# EAGLE design PCB-CCU-IRISCTRL_ETHERMEGA (EAGLE 7.1.0)

## Sheet 1 of 2
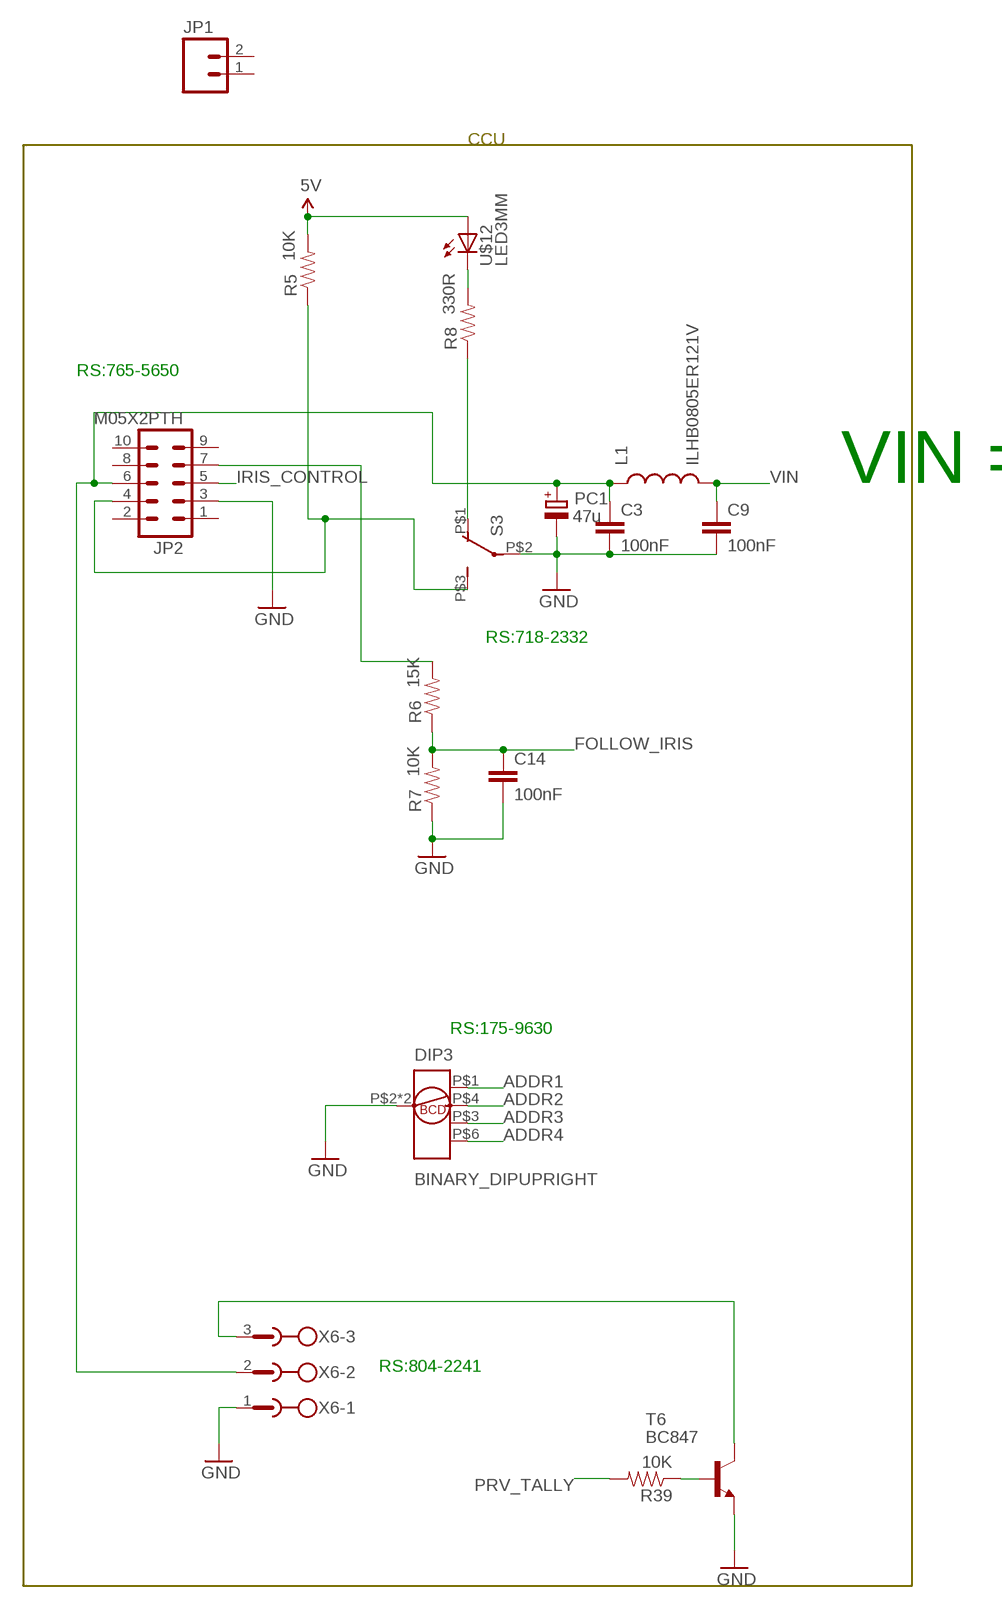
[diagram p0: schematic, sheet 1, part 1 of 3]
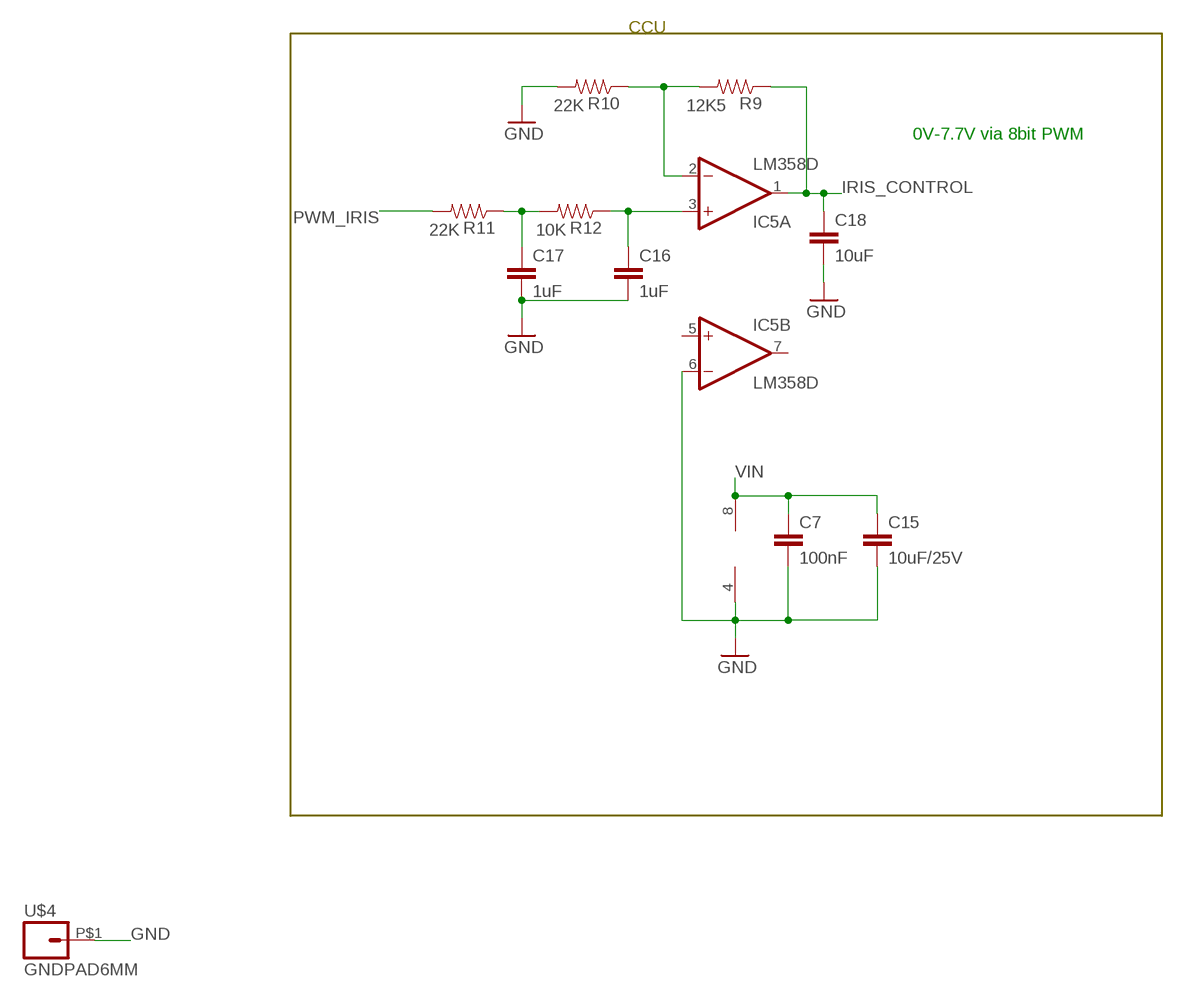
[diagram p1: schematic, sheet 1, part 2 of 3]
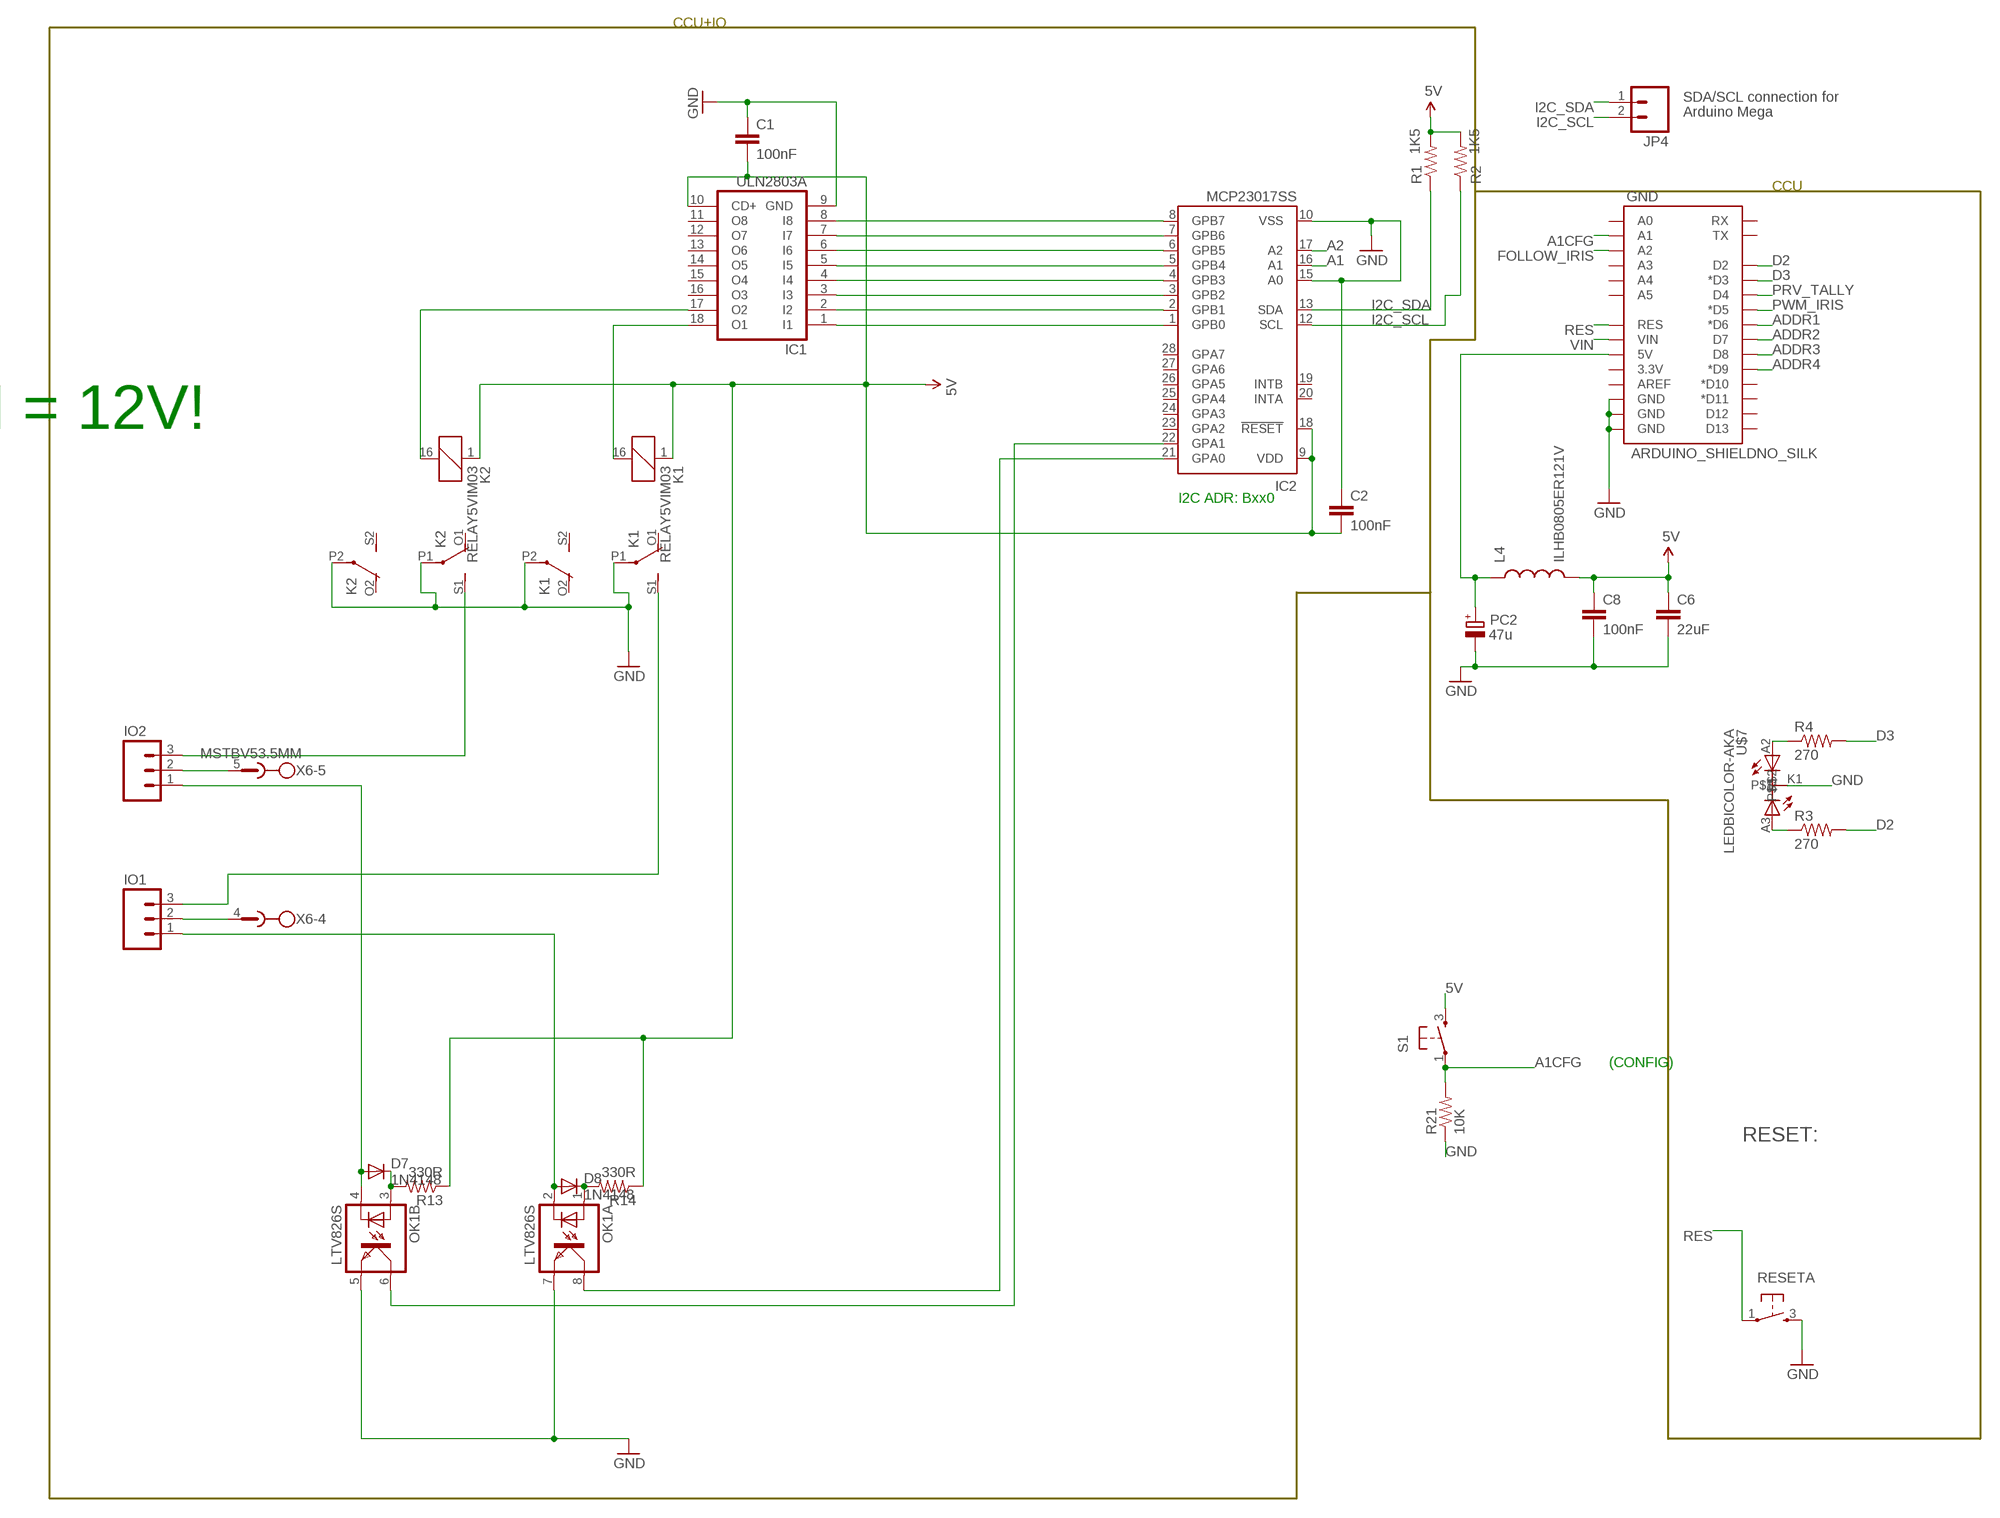
[diagram p2: schematic, sheet 1, part 3 of 3]

### Parts
C1  100nF  CAP0805  [0805]
C2  100nF  CAP0603-CAP  [0603-CAP]
C3  100nF  CAP0603-CAP  [0603-CAP]
C6  22uF  CAP0805  [0805]
C7  100nF  CAP0603-CAP  [0603-CAP]
C8  100nF  CAP0603-CAP  [0603-CAP]
C9  100nF  CAP0603-CAP  [0603-CAP]
C14  100nF  CAP0603-CAP  [0603-CAP]
C15  10uF/25V  CAP0805  [0805]
C16  1uF  CAP0805  [0805]
C17  1uF  CAP0805  [0805]
C18  10uF  CAP0805  [0805]
D7  1N4148  DIODESOD  [SOD-323]
D8  1N4148  DIODESOD  [SOD-323]
DIP3  BINARY_DIPUPRIGHT  [P65SMT_UPRIGHT_TH]
GND  ARDUINO_SHIELDNO_SILK  [DUEMILANOVE_VIAS]
IC1  ULN2803A  ULN2803ASO18W  [SO18W]
IC2  MCP23017SS  [SSOP28]
IC5  LM358D  [SO08]
IO1  M03LOCK  [1X03_LOCK]
IO2  M03LOCK  [1X03_LOCK]
JP1  M02PTH  [1X02]
JP2  M05X2PTH  [AVR_ICSP]
JP4  M02PTH  [1X02]
K1  RELAY5VIM03  [DS2Y]
K2  RELAY5VIM03  [DS2Y]
L1  ILHB0805ER121V  INDUCTOR0805  [0805]
L4  ILHB0805ER121V  INDUCTOR0805  [0805]
OK1  LTV826S  [DIL8-SMD]
PC1  47u  CPOL-EUD  [PANASONIC_D]
PC2  47u  CPOL-EUD  [PANASONIC_D]
R1  1K5  RESISTOR0603-RES  [0603-RES]
R2  1K5  RESISTOR0603-RES  [0603-RES]
R3  270  RESISTOR0603-RES  [0603-RES]
R4  270  RESISTOR0603-RES  [0603-RES]
R5  10K  RESISTOR0603-RES  [0603-RES]
R6  15K  RESISTOR0603-RES  [0603-RES]
R7  10K  RESISTOR0603-RES  [0603-RES]
R8  330R  RESISTOR0603-RES  [0603-RES]
R9  12K5  RESISTOR0603-RES  [0603-RES]
R10  22K  RESISTOR0603-RES  [0603-RES]
R11  22K  RESISTOR0603-RES  [0603-RES]
R12  10K  RESISTOR0603-RES  [0603-RES]
R13  330R  RESISTOR0603-RES  [0603-RES]
R14  330R  RESISTOR0603-RES  [0603-RES]
R21  10K  RESISTOR0603-RES  [0603-RES]
R39  10K  RESISTOR0603-RES  [0603-RES]
RESETA  TAC_SWITCH  [PUSHBUTTON]
S1  TAC_SWITCH  [PUSHBUTTON]
S3  SWITCH-DPST  [TECONNECTIVITY-DPST]
T6  BC847  [SOT23]
U$4  GNDPAD6MM  [3.2MMPAD6MM]
U$7  LEDBICOLOR-AKA  [LED5MM-BICOLOR]
U$12  LED3MM  [LED3MM]
X6  MSTBV53.5MM  [MSTBV5-3.5]

### Nets
5V [Power]: C1.2 C2.2 C6.1 C8.1 IC1.10(CD+) IC2.9(VDD) IC2.18(!RESET) K1.1 K2.1 L4.2 R1.2 R2.2 R5.2 R13.1 R14.1 S1.3 U$12.A
_IRIS_MANUAL: JP2.4 R5.1 S3.P$3(S)
A1: IC2.16(A1)
A1CFG: GND.A1 R21.2 S1.1
A2: IC2.17(A2)
ADDR1: DIP3.P$1 GND.D6(*D6)
ADDR2: DIP3.P$4 GND.D7
ADDR3: DIP3.P$3 GND.D8
ADDR4: DIP3.P$6 GND.D9(*D9)
ARD_5V [Power]: GND.5V L4.1 PC2.+
D2: GND.D2 R3.2
D3: GND.D3(*D3) R4.2
FOLLOW_IRIS: C14.1 GND.A2 R6.1 R7.2
GND [Power]: C1.1 C2.1 C3.2 C6.2 C7.2 C8.2 C9.2 C14.2 C15.2 C16.2 C17.2 C18.2 DIP3.P$2(GND) DIP3.P$5(GND) GND.GND@0(GND) GND.GND@1(GND) GND.GND@2(GND) IC1.9(GND) IC2.10(VSS) IC2.15(A0) IC5.4(P:V-) IC5.6(B:-IN) JP2.3 K1.P1(2:P) K1.P2(3:P) K2.P1(2:P) K2.P2(3:P) OK1.5(B:EMIT) OK1.7(A:EMIT) PC1.- PC2.- R7.1 R10.2 R21.1 RESETA.3 S3.P$2(P) T6.2(E) U$4.P$1 U$7.K1 X6.1
I2C_SCL: IC2.12(SCL) JP4.2 R2.1
I2C_SDA: IC2.13(SDA) JP4.1 R1.1
IRIS_CONTROL: C18.1 IC5.1(A:OUT) JP2.5 R9.1
N$1: IO2.3 K2.S1(2:S)
N$4: IC1.18(O1) K1.16
N$5: IC1.1(I1) IC2.1(GPB0)
N$6: IO2.2 X6.5
N$7: R4.1 U$7.A2
N$9: IC1.17(O2) K2.16
N$10: IO1.3 K1.S1(2:S)
N$11: R3.1 U$7.A3
N$12: IO1.2 X6.4
N$13: R39.1 T6.1(B)
N$14: JP2.7 R6.2
N$15: R8.1 S3.P$1(O)
N$16 [Power]: C3.1 JP2.6 L1.1 PC1.+ X6.2
N$17: R8.2 U$12.K(C)
N$18: C17.1 R11.1 R12.2
N$20: C16.1 IC5.3(A:+IN) R12.1
N$22: IC5.2(A:-IN) R9.2 R10.1
N$34: IC1.2(I2) IC2.2(GPB1)
N$35: IC1.3(I3) IC2.3(GPB2)
N$36: IC1.4(I4) IC2.4(GPB3)
N$37: IC1.5(I5) IC2.5(GPB4)
N$38: IC1.6(I6) IC2.6(GPB5)
N$39: IC1.7(I7) IC2.7(GPB6)
N$40: IC1.8(I8) IC2.8(GPB7)
N$47: D7.1(C) OK1.3(B:A) R13.2
N$48: D8.1(C) OK1.1(A:A) R14.2
N$49 [INput lines]: D8.2(A) IO1.1 OK1.2(A:C)
N$51: IC2.21(GPA0) OK1.8(A:COL)
N$60 [INput lines]: D7.2(A) IO2.1 OK1.4(B:C)
N$68: IC2.22(GPA1) OK1.6(B:COL)
PRV_TALLY: GND.D4 R39.2
PWM_IRIS: GND.D5(*D5) R11.2
RES: GND.RES RESETA.1
RESET: T6.3(C) X6.3
VIN [Power]: C7.1 C9.1 C15.1 GND.VIN IC5.8(P:V+) L1.2
Unconnected: GND.3.3V GND.A0 GND.A3 GND.A4 GND.A5 GND.AREF GND.D10(*D10) GND.D11(*D11) GND.D12 GND.D13 GND.RX GND.TX IC1.11(O8) IC1.12(O7) IC1.13(O6) IC1.14(O5) IC1.15(O4) IC1.16(O3) IC2.19(INTB) IC2.20(INTA) IC2.23(GPA2) IC2.24(GPA3) IC2.25(GPA4) IC2.26(GPA5) IC2.27(GPA6) IC2.28(GPA7) IC5.5(B:+IN) IC5.7(B:OUT) JP1.1 JP1.2 JP2.1 JP2.2 JP2.8 JP2.9 JP2.10 K1.O1(2:O) K1.O2(3:O) K1.S2(3:S) K2.O1(2:O) K2.O2(3:O) K2.S2(3:S)

### Notes on the sheet
- CCU
- 0V-7.7V via 8bit PWM
- CCU+IO
- SDA/SCL connection for
- Arduino Mega
- CCU
- CCU
- RS:765-5650
- VIN = 12V!
- I2C ADR: Bxx0
- RS:718-2332
- RS:175-9630
- (CONFIG)
- RESET:
- RS:804-2241

## Sheet 2 of 2

## Library data of the parts
C1-C3 C6-C9 C14-C18 = SparkFun:CAP: Capacitor Standard 0603 ceramic capacitor, and 0.1" leaded capacitor.
D7 D8 = SparkFun-DiscreteSemi:DIODE: Diode These are standard reverse protection diodes and small signal diodes. SMA package can handle up to about 1A. SOD-323 can handle about 200mA. What the SOD-323 package when ordering, there are some mfgs out there that are 5-pin packages.; PROD_ID: DIO-09646
DIP3 = SKAARHOJ:BINARY_DIP
GND = SparkFun:ARDUINO_SHIELD
IC1 = uln-udn:ULN2803A: DRIVER ARRAY
IC2 = microchip:MCP23017: http://ww1.microchip.com/downloads/en/DeviceDoc/21952a.pdf Source: http://ww1.microchip.com/downloads/en/DeviceDoc/21952a.pdf; MF: MICROCHIP; MPN: MCP23017-E/SS; OC_FARNELL: 1467674; OC_NEWARK: 31K2960
IC5 = linear:LM358: OP AMP also LM158; LM258; LM2904 Source: http://cache.national.com/ds/LM/LM158.pdf
IO1 IO2 = SparkFun:M03: Header 3 Standard 3-pin 0.1" header. Use with straight break away headers (SKU : PRT-00116), right angle break away headers (PRT-00553), swiss pins (PRT-00743), machine pins (PRT-00117), and female headers (PRT-00115). Molex polarized connector foot print use with SKU : PRT-08232 with associated crimp pins and housings.
JP1 JP4 = SparkFun:M02: Header 2 Standard 2-pin 0.1" header. Use with straight break away headers (SKU : PRT-00116), right angle break away headers (PRT-00553), swiss pins (PRT-00743), machine pins (PRT-00117), and female headers (PRT-00115). Molex polarized connector foot print use with SKU : PRT-08233 with associated crimp pins and housings.
JP2 = SparkFun:M05X2: Header 5x2 Standard 10-pin dual row 0.1" header. Commonly used with AVR-ISP. Use with Spark Fun Electronics SKU: PRT-00778
K1 K2 = SKAARHOJ:RELAY5V: RELAY 2 x switch, AxiCom 150 mW 5V
L1 L4 = SparkFun:INDUCTOR: Inductors Basic Inductor/Choke - 0603 and 1206. Footprints are not proven and vary greatly between part numbers.
OK1 = optocoupler:LTV826: OPTO COUPLER Source: LITEON, LTV816.pdf; OC_FARNELL: unknown; OC_NEWARK: unknown
PC1 PC2 = rcl:CPOL-EU: POLARIZED CAPACITOR, European symbol
R1-R14 R21 R39 = SparkFun:RESISTOR: Resistor Basic schematic elements and footprints for 0603, 1206, and PTH resistors.
RESETA S1 = SKAARHOJ:TAC_SWITCH: Momentary Switch Button commonly used for reset or general input. Spark Fun Electronics SKU : COM-00097
S3 = SKAARHOJ:SWITCH-DPST: DPDT Version of the COM-00597
T6 = transistor:BC847: NPN TRANSISTOR
U$4 = SKAARHOJ:GNDPAD
U$7 = SKAARHOJ:LEDBICOLOR-AKA
U$12 = SKAARHOJ:LED: KINGBRIGHT 20MM BIG LAMP
X6 = SKAARHOJ:MSTBV5: PHOENIX

## Net classes
0 default: width 0.203 mm, clearance 0.203 mm
1 Power: width 0.305 mm, drill 0.305 mm, clearance 0.203 mm
2 RELAY LINES: width 0.305 mm, drill 0.305 mm, clearance 0.203 mm
3 INput lines: width 0.203 mm, clearance 0.203 mm

## Board
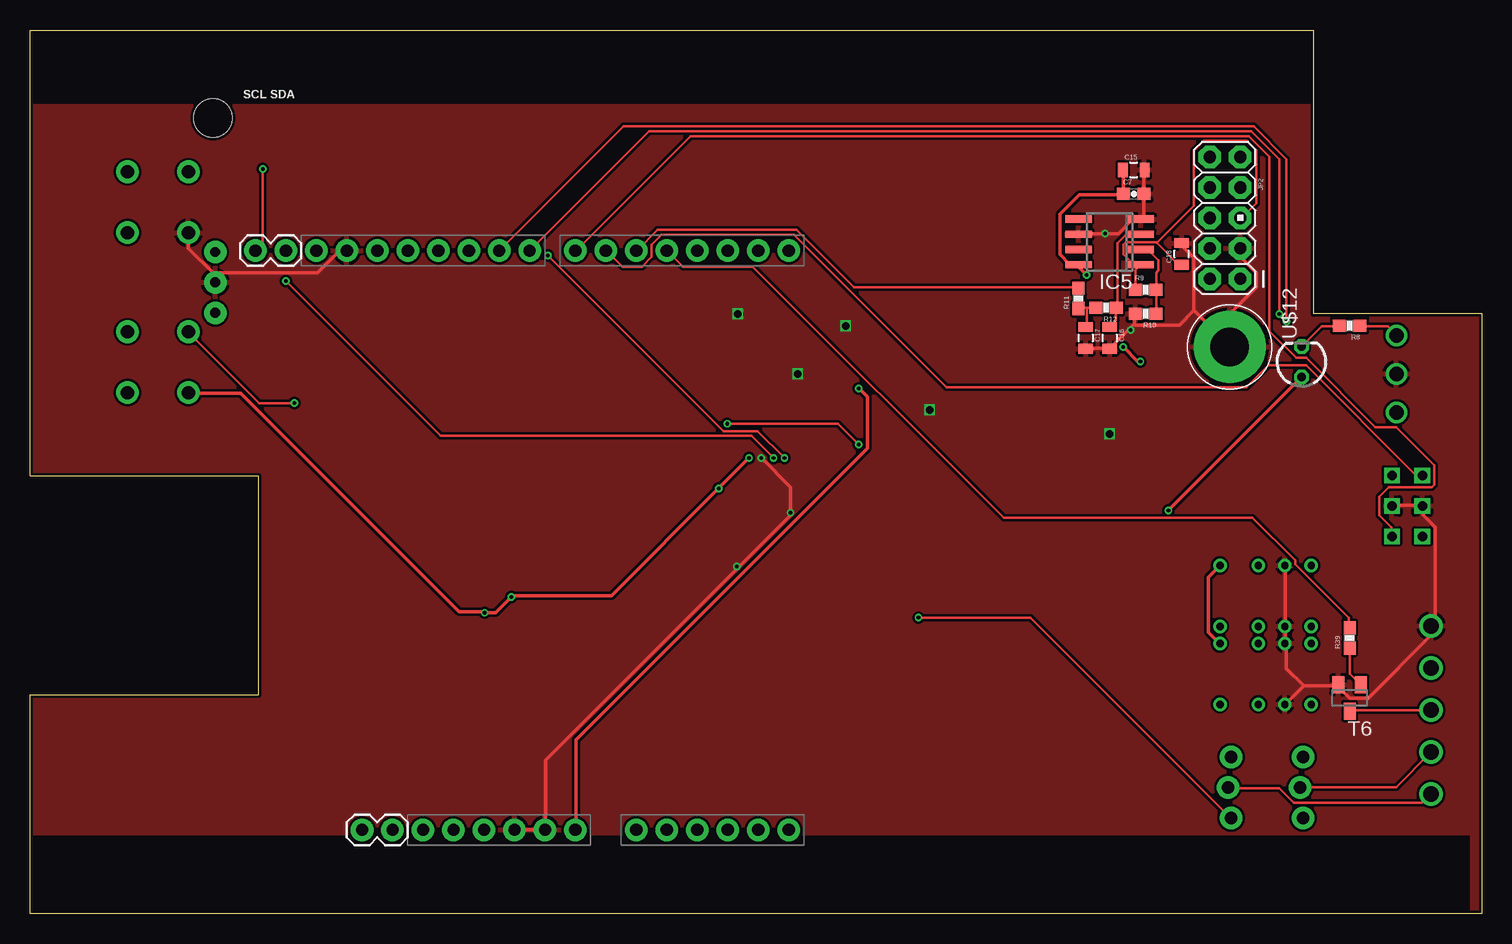
[diagram p3: board, top side]
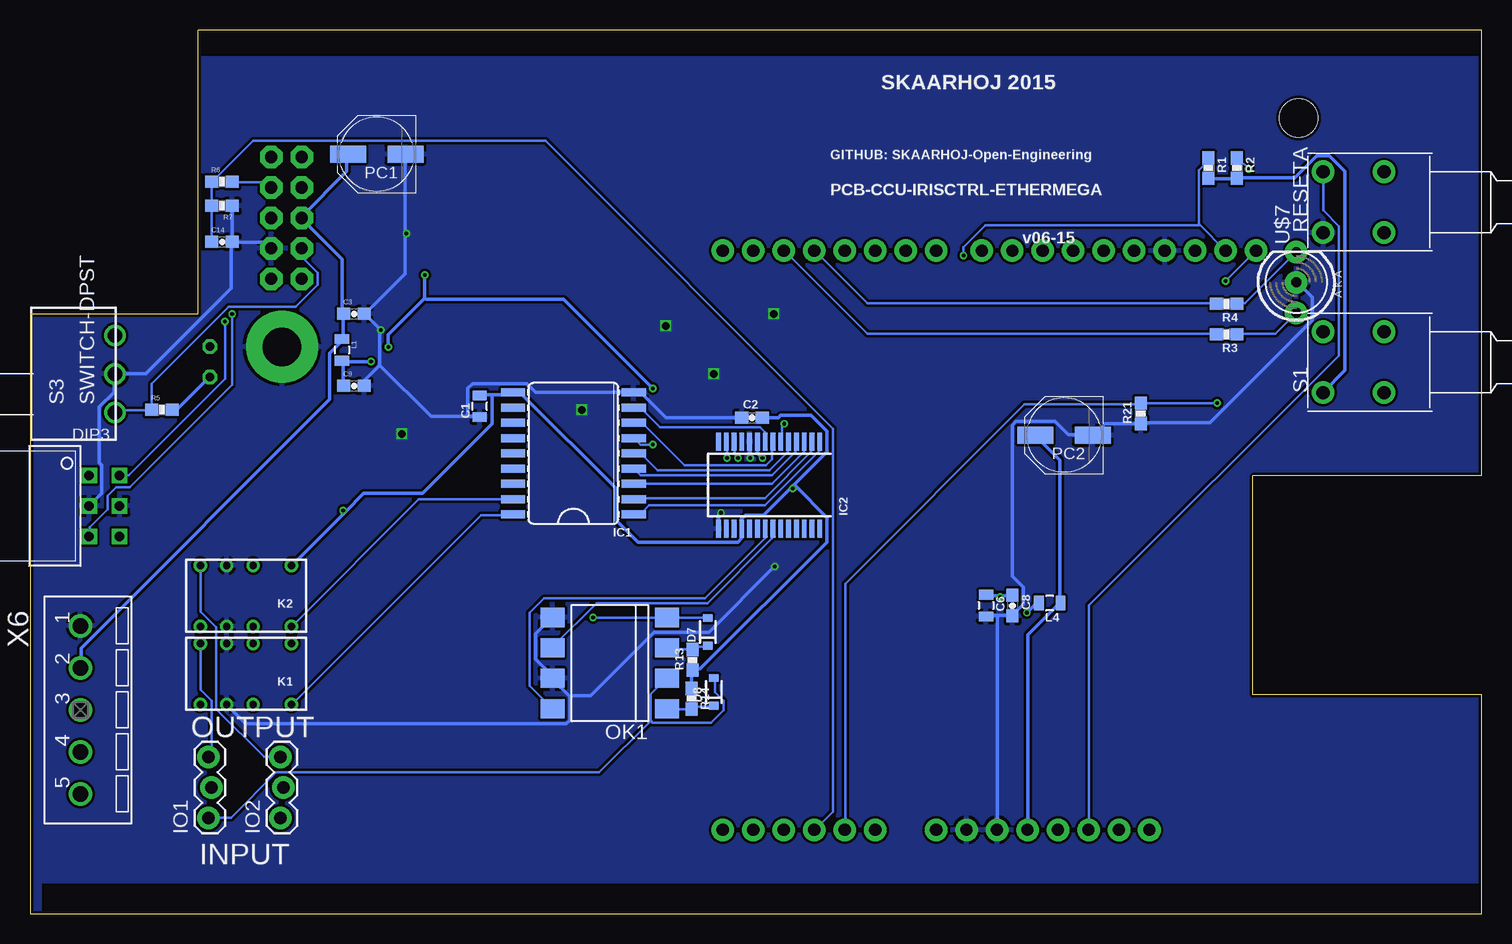
[diagram p4: board, bottom side, seen from below]

Size 121 x 73.66 mm. Coordinates in mm from the lower left corner, seen from the top.
Outline: 0,0 0,18.26 19.05,18.26 19.05,36.5 0,36.5 0,73.66 107,73.66 107,50 121,50 121,0 0,0
Copper layers (1*16): Top 0.035mm / dielectric 1.5mm / Bottom 0.035mm
Design rules "Fusion_eagle_rule_v1.1": minimum track width 6mil, minimum drill 12mil, track to track 6mil, track to pad 6mil, pad to pad 6mil, via to via 6mil, smd to smd 0mil, copper to edge 10mil, drill to drill 10mil, minimum pad ring 10mil, minimum via ring 6mil, stop-mask expansion 2mil, vias tented up to drill 100mil, thermal gap 10mil
Holes 3.2 mm at 15.24,66.31
tRestrict: area 0,0 to 120,6.5; area 0,67.5 to 107,74
bRestrict: area 0,71.5 to 107,74; area 0,0 to 120,2.5

### Footprints (pad centres in the part's own frame; a part is rotated, then mirrored left to right if it is on the bottom)
0805 = smd 0.8 x 1.2: 1 -0.9,0; 2 0.9,0
0603-CAP = smd 1.1 x 1: 1 -0.85,0; 2 0.85,0
SOD-323 = smd 0.63 x 0.83: 1 -1.15,0; 2 1.15,0
P65SMT_UPRIGHT_TH = drill 0.8 square: P$1 -2.54,-1.27; P$2 0,-1.27; P$3 2.54,-1.27; P$4 2.54,1.27; P$5 0,1.27; P$6 -2.54,1.27
DUEMILANOVE_VIAS = drill 1.016 pad 1.88: 3.3V 50.8,13.97; 5V 50.8,16.51; A0 50.8,29.21; A1 50.8,31.75; A2 50.8,34.29; A3 50.8,36.83; A4 50.8,39.37; A5 50.8,41.91; AREF 2.54,2.54; D2 2.54,36.83; D3 2.54,34.29; D4 2.54,31.75; D5 2.54,29.21; D6 2.54,26.67; D7 2.54,24.13; D8 2.54,20.32; D9 2.54,17.78; D10 2.54,15.24; D11 2.54,12.7; D12 2.54,10.16; D13 2.54,7.62; GND@0 50.8,19.05; GND@1 50.8,21.59; GND@2 2.54,5.08; RES 50.8,11.43; RX 2.54,41.91; TX 2.54,39.37; VIN 50.8,24.13
SO18W = smd 0.66 x 2.032: 1 -5.08,-5.029; 2 -3.81,-5.029; 3 -2.54,-5.029; 4 -1.27,-5.029; 5 0,-5.029; 6 1.27,-5.029; 7 2.54,-5.029; 8 3.81,-5.029; 9 5.08,-5.029; 10 5.08,5.029; 11 3.81,5.029; 12 2.54,5.029; 13 1.27,5.029; 14 0,5.029; 15 -1.27,5.029; 16 -2.54,5.029; 17 -3.81,5.029; 18 -5.08,5.029
SSOP28 = smd 0.4 x 1.5: 1 -4.225,-3.625; 2 -3.575,-3.625; 3 -2.925,-3.625; 4 -2.275,-3.625; 5 -1.625,-3.625; 6 -0.975,-3.625; 7 -0.325,-3.625; 8 0.325,-3.625; 9 0.975,-3.625; 10 1.625,-3.625; 11 2.275,-3.625; 12 2.925,-3.625; 13 3.575,-3.625; 14 4.225,-3.625; 15 4.225,3.625; 16 3.575,3.625; 17 2.925,3.625; 18 2.275,3.625; 19 1.625,3.625; 20 0.975,3.625; 21 0.325,3.625; 22 -0.325,3.625; 23 -0.975,3.625; 24 -1.625,3.625; 25 -2.275,3.625; 26 -2.925,3.625; 27 -3.575,3.625; 28 -4.225,3.625
SO08 = smd 0.6 x 2.2: 1 -1.905,-2.6; 2 -0.635,-2.6; 3 0.635,-2.6; 4 1.905,-2.6; 5 1.905,2.6; 6 0.635,2.6; 7 -0.635,2.6; 8 -1.905,2.6
1X03_LOCK = drill 1.016 pad 1.88: 1 0,0.127; 2 2.54,-0.127; 3 5.08,0.127
1X02 = drill 1.016 pad 1.88: 1 0,0; 2 2.54,0
AVR_ICSP = drill 1.016 pad 1.88 octagon: 1 -1.27,5.08; 2 1.27,5.08; 3 -1.27,2.54; 4 1.27,2.54; 5 -1.27,0; 6 1.27,0; 7 -1.27,-2.54; 8 1.27,-2.54; 9 -1.27,-5.08; 10 1.27,-5.08
DS2Y = drill 0.6: 1 1.2,0.46; 16 1.2,5.54; O1 4.4,0.46; O2 4.4,5.54; P1 6.6,0.46; P2 6.6,5.54; S1 8.8,0.46; S2 8.8,5.54
DIL8-SMD = smd 1.6 x 2: 1 -3.81,-4.77; 2 -1.27,-4.77; 3 1.27,-4.77; 4 3.81,-4.77; 5 3.81,4.77; 6 1.27,4.77; 7 -1.27,4.77; 8 -3.81,4.77
PANASONIC_D = smd 3 x 1.4: + 2.4,0; - -2.4,0
0603-RES = smd 1.1 x 1: 1 -0.85,0; 2 0.85,0
PUSHBUTTON = drill 1.1 pad 1.88: 1 2.54,2.54; 2 2.54,-2.54; 3 -2.54,2.54; 4 -2.54,-2.54
TECONNECTIVITY-DPST = drill 1.2: P$1 3,3.2; P$2 3,0; P$3 3,-3.2
SOT23 = smd 1 x 1.4: 1 -0.95,-1.1; 2 0.95,-1.1; 3 0,1.1
3.2MMPAD6MM = drill 3.2 pad 6: P$1 0,0
LED5MM-BICOLOR = drill 0.813 pad 1.88: A2 2.54,0; A3 -2.54,0; K1 0,0
LED3MM = drill 0.7 pad 1.2 octagon: A -1.27,0; K 1.27,0
MSTBV5-3.5 = drill 1.3: 1 -7,0; 2 -3.5,0; 3 0,0; 4 3.5,0; 5 7,0

### Placement (x,y rotation side)
C1  83.52,42.31 90 bottom
C2  60.81,41.35 0 bottom
C3  94,50 0 bottom
C6  41.3,25.7 270 bottom
C7  92,60 0 top
C8  39.1,25.7 270 bottom
C9  94,44 0 bottom
C14  105,56 0 bottom
C15  92,62 0 top
C16  90,48 270 top
C17  88,48 270 top
C18  96,55 90 top
D7  64.5,23.5 90 bottom
D8  64,18.5 90 bottom
DIP3  114.8,34 270 bottom
GND  21.34,57.81 270 top
IC1  75.7,38.38 90 bottom
IC2  59.39,35.73 180 bottom
IC5  90,56 90 top
IO1  106,8 90 bottom
IO2  100,8 90 bottom
JP1  27.69,7.01 0 top
JP2  99.62,58 180 top
JP4  21.34,55.27 180 top
K1  98,23 180 bottom
K2  98,29.5 180 bottom
L1  95,47 270 bottom
L4  36,25.9 180 bottom
OK1  72.67,20.9 90 bottom
PC1  92.1,63.3 180 bottom
PC2  34.8,39.9 180 bottom
R1  22.77,62.15 270 bottom
R2  20.4,62.15 270 bottom
R3  21.24,48.29 180 bottom
R4  21.24,50.83 180 bottom
R5  110,42 0 bottom
R6  105,61 0 bottom
R7  105,59 180 bottom
R8  110,49 180 top
R9  93,52 0 top
R10  93,50 180 top
R11  87.4,51.3 90 top
R12  89.7,50.5 180 top
R13  65.76,21.18 90 bottom
R14  65.86,17.93 270 bottom
R21  28.41,41.72 90 bottom
R39  110,23 90 top
RESETA  10.67,59.31 90 bottom
S1  10.67,45.97 90 bottom
S3  116.9,45 0 bottom
T6  110,18 180 top
U$4  100,47.25 0 top
U$7  15.44,52.63 90 bottom
U$12  106,46 90 top
X6  116.8,17 270 bottom

### Tracks (layer width: path | path; a pad name or v marks a point on that pad's centre or on a via)
5V  (via drill 0.3)
  Top 0.305: K1.1 99.16,22.55 98.25,23.47 98.25,28.04 99.16,28.96 K2.1 | v94.89,33.63 105.97,44.7 U$12.A | v59.94,38 v57.4,35.46 48.46,26.52 40.23,26.52 v40.13,26.42 38.81,25.09 v37.9,25.09 37.8,25.2 35.76,25.2 17.58,43.38 13.21,43.38 S1.3
  Bottom 0.305: R5.2 109.12,42.06 108.71,42.06 106.07,44.7 U$12.A | 82.5,43.28 80.87,43.28 80.77,43.38 IC1.10 80.67,43.28 79.96,43.28 72.14,35.46 72.14,32.82 70.31,30.99 61.98,30.99 61.67,31.29 61.67,32 IC2.18 61.67,32.92 61.37,33.22 59.84,33.22 57.51,35.56 | 82.5,43.28 83.52,43.28 C1.2 | 82.5,43.28 82.5,40.84 88.29,35.05 93.17,35.05 94.69,33.53 | 94.69,33.53 99.16,29.06 K2.1 | v94.89,33.63 94.79,33.63 94.69,33.53 | R1.2 22.76,61.27 20.42,61.27 R2.2 20.32,61.37 15.54,61.37 13.72,63.2 12.7,63.2 11.38,61.87 11.38,45.31 13.21,43.48 S1.3 | 40.13,26.52 41.25,26.52 C6.1 | 40.13,26.52 39.12,26.52 C8.1 | v37.9,25.09 37.19,25.81 36.98,25.81 L4.2 | v40.13,26.42 40.13,26.52 | R14.1 65.84,18.8 65.84,20.32 R13.1 65.63,20.42 65.13,20.42 54.56,30.99 54.56,33.02 57.2,35.66 v57.4,35.46 57.51,35.56 | 57.51,35.56 54.56,38.51 54.56,40.23 55.88,41.55 58.42,41.55 58.62,41.35 59.94,41.35 C2.2 | v59.94,38 60.35,38.41 60.35,39.32 IC2.9
_IRIS_MANUAL
  Bottom 0.203: S3.P$3 113.89,41.86 113.79,41.96 110.95,41.96 R5.1 110.85,42.06 110.85,44.2 104.44,50.6 98.86,50.6 97.03,52.43 97.03,53.44 98.35,54.76 98.35,55.37 JP2.4
A1CFG  (via drill 0.3)
  Top 0.203: v22.05,42.57 19.1,42.57 13.21,48.46 S1.1
  Bottom 0.203: v22.05,42.57 28.35,42.57 R21.2 28.45,42.47 38.1,42.47 53.03,27.53 53.03,7.01 GND.A1
ADDR1
  Top 0.203: DIP3.P$1 116.03,36.58 115.52,36.58 106.38,45.72 103.23,45.72 101.4,43.89 76.4,43.89 63.7,56.59 52.63,56.59 51.82,55.78 51.82,54.76 51,53.95 49.38,53.95 48.06,55.27 GND.D6
ADDR2
  Top 0.203: DIP3.P$4 113.49,31.5 113.49,32.21 112.47,33.22 112.47,34.75 113.28,35.56 116.84,35.56 117.04,35.76 117.04,37.39 113.89,40.54 112.17,40.54 106.38,46.33 105.56,46.33 103.33,48.56 103.33,63.09 101.6,64.82 55.07,64.82 45.52,55.27 GND.D7
ADDR3  (via drill 0.3)
  Top 0.203: v104.14,49.99 104.14,62.89 101.8,65.23 51.61,65.23 GND.D8
  Bottom 0.203: v104.14,49.99 104.14,44.09 112.67,35.56 113.79,35.56 114.5,34.85 114.5,33.73 116.03,32.21 116.03,31.5 DIP3.P$3
ADDR4  (via drill 0.3)
  Top 0.203: v104.75,49.38 104.75,62.89 102.01,65.63 49.48,65.63 GND.D9
  Bottom 0.203: v104.75,49.38 104.75,44.6 112.78,36.58 113.49,36.58 DIP3.P$6
ARD_5V
  Bottom 0.305: PC2.+ 37.19,39.83 35.15,37.8 35.15,25.91 L4.1 35.26,25.81 37.8,23.27 37.8,7.01 GND.5V
D2
  Bottom 0.203: R3.2 22.15,48.36 51.21,48.36 58.12,55.27 GND.D2
D3
  Bottom 0.203: R4.2 22.15,50.9 51.21,50.9 55.58,55.27 GND.D3
FOLLOW_IRIS
  Bottom 0.203: C14.1 105.87,56.08 105.87,58.93 R7.2 105.87,59.03 105.87,60.96 R6.1 105.77,61.06 102.41,64.41 78.03,64.41 54.05,40.44 54.05,8.53 55.58,7.01 GND.A2
GND  (via drill 0.3, 0.6)
  Top 0.305: C15.2 92.86,61.98 92.86,60.05 C7.2 92.86,59.84 92.86,58.12 92.66,57.91 IC5.4 92.46,57.91 91.95,57.91 90.73,56.69 v89.61,56.69 87.48,56.69 IC5.6 | 92.05,49.17 92.05,49.99 R10.2 | 91.64,48.77 90.02,47.14 C16.2 89.92,47.14 88.09,47.14 C17.2 | 91.64,48.77 92.05,49.17 | 97.03,50.29 97.03,54.66 96.01,55.68 96.01,55.88 C18.2 | 97.03,50.29 99.97,47.35 U$4.P$1 98.75,48.77 102.21,52.22 102.21,53.44 100.99,54.66 100.99,55.37 JP2.3 | 97.03,50.29 95.81,49.07 92.15,49.07 92.05,49.17 | DIP3.P$5 113.59,34.04 116.03,34.04 DIP3.P$2 116.13,33.93 116.13,33.22 117.14,32.21 117.14,24.38 116.84,24.08 X6.1 116.74,23.88 116.74,23.16 111.56,17.98 110.03,17.98 109.12,18.9 T6.2 109.02,19 106.17,19 | K2.P1 104.65,28.96 104.65,24.08 K2.P2 104.65,23.88 104.65,22.55 K1.P1 104.75,22.45 104.75,20.42 106.17,19 | 106.17,19 104.65,17.48 K1.P2 | v91.75,48.67 91.64,48.77 | RESETA.3 13.21,55.47 15.34,53.34 15.34,52.63 U$7.K1 15.44,53.44 23.98,53.44 25.81,55.27 GND.GND@2 | v60.96,38 63.4,35.56 v63.4,33.43 63.3,33.33 63.3,33.12 59.03,28.85 | GND.GND@0 GND.GND@1 42.98,7.11 42.98,12.8 59.03,28.85 | v58.93,28.96 59.03,28.85
  Bottom 0.305: C2.1 67.97,41.35 70,43.38 70.61,43.38 IC1.9 70.81,43.48 78.84,43.48 79.55,44.2 84.12,44.2 84.53,43.79 84.53,41.45 | 91.85,45.72 93.07,44.5 93.07,44.09 C9.2 | 91.85,48.67 91.85,48.77 93.07,49.99 C3.2 92.96,50.09 89.71,53.34 89.71,56.69 | 91.85,48.67 91.85,45.72 | 84.53,41.45 87.58,41.45 91.85,45.72 | 84.53,41.45 83.62,41.45 C1.1 | 89.71,56.69 89.71,63.3 PC1.- | v89.61,56.69 89.71,56.69 | C14.2 104.14,56.08 104.14,58.93 R7.1 | C14.2 104.04,55.98 101.5,55.98 100.99,55.47 JP2.3 | DIP3.P$2 116.03,34.04 115.01,35.05 115.01,37.39 115.21,37.59 115.21,42.27 114,43.48 114,44.91 S3.P$2 113.79,45.01 111.35,45.01 104.24,52.12 104.24,55.88 C14.2 | OK1.5 77.52,24.69 78.84,23.37 78.84,21.23 77.52,19.91 77.52,19.71 OK1.7 77.42,19.51 76,18.09 | 76,18.09 76,16.15 76.3,15.85 103.02,15.85 104.55,17.37 K1.P2 | v91.75,48.67 91.85,48.67 | U$7.K1 15.34,52.63 14.12,51.41 14.12,49.48 22.66,40.95 28.35,40.95 R21.1 28.45,40.84 31.39,40.84 32.31,39.93 PC2.- 32.51,39.93 34.44,39.93 35.56,41.05 38.81,41.05 39.12,40.74 39.12,28.14 38.2,27.23 38.2,25.81 39.01,24.99 C8.2 39.12,24.89 40.34,24.89 | v63.4,33.43 63.6,33.22 63.6,32.11 IC2.15 | v60.96,38 60.96,39.32 IC2.10 | 40.34,24.89 41.25,24.89 C6.2 | 40.34,24.89 40.34,7.01 GND.GND@0 | v58.93,28.96 64.41,23.47 68.99,23.47 74.27,18.19 75.89,18.19 76,18.09
  other vias: 59,50 68,49 64,45 75,42 90,40
  pour Bottom: 0,0 121,0 121,74 0,74
  pour Top: 0,0 121,0 121,74 0,74
I2C_SCL  (via drill 0.3)
  Top 0.203: v19.41,62.08 19.41,55.88 JP4.2 | v61.98,38 60.15,39.83 34.24,39.83 v21.34,52.73
  Bottom 0.203: v19.41,62.08 20.32,62.99 R2.1 | v61.98,38 62.28,38.3 62.28,39.32 IC2.12 | JP4.2 v21.34,52.73
I2C_SDA  (via drill 0.3)
  Top 0.203: v62.89,38 60.66,40.23 57.81,40.23 v43.18,54.86
  Bottom 0.203: JP4.1 23.52,57.45 | 23.52,57.45 23.57,57.51 23.57,61.98 22.86,62.69 22.86,62.99 R1.1 | v62.89,38 62.89,39.32 IC2.13 | v43.18,54.86 43.18,55.58 41.35,57.4 23.57,57.4 23.52,57.45
IRIS_CONTROL
  Top 0.203: R9.1 92.15,52.02 92.15,53.65 92.56,54.05 IC5.1 92.25,53.85 91.14,54.97 91.14,55.78 91.34,55.98 93.88,55.98 93.93,55.93 | 93.93,55.93 95.71,54.15 95.91,54.15 C18.1 | 93.93,55.93 97.03,59.03 97.03,63.6 97.84,64.41 101.4,64.41 102.21,63.6 102.21,59.23 100.99,58.01 JP2.5
N$1
  Bottom 0.203: K2.S1 106.78,28.96 106.78,25.2 105.46,23.88 105.46,17.07 101.5,13.11 100.18,13.11 IO2.3
N$4
  Bottom 0.203: IC1.18 80.77,33.22 83.41,33.22 99.16,17.48 K1.16
N$5
  Bottom 0.203: IC2.1 55.17,39.32 55.17,38.61 59.74,34.04 69.39,34.04 70.1,33.33 70.61,33.33 IC1.1
N$6
  Top 0.203: IO2.2 99.97,10.46 104.14,10.46 105.36,9.25 116.03,9.25 116.74,9.96 X6.5
N$7
  Bottom 0.203: R4.1 20.32,50.9 19.71,50.9 U$7.A2
N$9
  Bottom 0.203: IC1.17 80.77,34.54 88.59,34.54 99.16,23.98 K2.16
N$10
  Bottom 0.203: K1.S1 106.78,22.45 106.78,18.69 105.87,17.78 105.87,13.31 106.07,13.11 IO1.3
N$11
  Bottom 0.203: R3.1 20.32,48.36 17.17,48.36 U$7.A3
N$12
  Top 0.203: IO1.2 105.97,10.57 113.89,10.57 116.74,13.41 X6.4
N$13
  Top 0.203: R39.1 110.03,22.15 110.03,20.02 T6.1
N$14
  Bottom 0.203: R6.2 104.14,60.96 101.4,60.96 100.99,60.55 JP2.7
N$15
  Top 0.203: R8.1 110.95,48.97 113.18,48.97 113.89,48.26 S3.P$1
N$16
  Bottom 0.305: PC1.+ 94.59,63.3 94.59,61.87 98.35,58.12 JP2.6 98.35,57.91 95,54.56 95,50.09 C3.1 94.89,49.99 94.89,48.06 95,47.95 L1.1 95,47.75 96.01,46.74 96.01,42.88 116.74,22.15 116.74,20.52 X6.2
N$17
  Top 0.203: R8.2 109.12,48.97 107.7,48.97 106.07,47.35 U$12.K
N$18
  Top 0.203: 88.09,50.49 88.8,50.49 R12.2 | 88.09,50.49 87.48,50.49 R11.1 | 88.09,50.49 88.09,48.97 C17.1
N$20
  Top 0.203: C16.1 90.02,48.97 90.53,49.48 90.53,50.49 R12.1 90.63,50.6 90.63,55.88 91.34,56.59 92.56,56.59 IC5.3
N$22
  Top 0.203: R10.1 93.88,50.09 93.88,51.92 R9.2 93.88,52.02 93.88,53.44 94.08,53.65 94.08,54.46 93.27,55.27 92.66,55.27 IC5.2
N$34
  Bottom 0.203: IC2.2 55.88,39.32 55.88,38.51 59.74,34.65 70.61,34.65 IC1.2
N$35
  Bottom 0.203: IC2.3 56.49,39.32 56.49,38.51 59.13,35.87 70.61,35.87 IC1.3
N$36
  Bottom 0.203: IC2.4 57.2,39.32 57.2,38.51 59.13,36.58 70.1,36.58 70.61,37.08 IC1.4
N$37
  Bottom 0.203: IC2.5 57.81,39.32 57.81,38.51 59.33,36.98 68.68,36.98 70,38.3 70.61,38.3 IC1.5
N$38  (via drill 0.3)
  Top 0.203: v58.12,40.84 67.36,40.84 v69.09,39.12
  Bottom 0.203: v58.12,40.84 58.32,40.64 58.32,39.42 IC2.6 | v69.09,39.12 70.1,39.12 70.61,39.62 IC1.6
N$39
  Bottom 0.203: IC2.7 59.13,39.32 59.13,37.9 59.64,37.39 66.45,37.39 69.9,40.84 70.61,40.84 IC1.7
N$40
  Bottom 0.203: IC2.8 59.74,39.42 59.74,40.13 60.15,40.54 68.48,40.54 70.1,42.16 70.61,42.16 IC1.8
N$47
  Bottom 0.203: D7.1 64.52,22.25 65.53,22.25 65.73,22.05 R13.2 65.84,22.05 67.77,22.05 67.87,22.15 OK1.3
N$48
  Bottom 0.203: D8.1 64.01,17.27 65.73,17.27 65.84,17.17 R14.2 65.94,17.07 67.87,17.07 OK1.1
N$49
  Bottom 0.203: 69.24,16.1 69.29,16.15 69.29,18.29 67.97,19.61 OK1.2 | 69.24,16.1 69.09,15.95 64.21,15.95 63.2,16.97 63.2,17.78 63.91,18.49 63.91,19.61 D8.2 | 69.24,16.1 73.56,11.79 100.48,11.79 104.24,8.03 106.07,8.03 IO1.1
N$51
  Bottom 0.203: IC2.21 59.74,32 59.74,31.29 64.72,26.31 78.13,26.31 79.35,25.09 79.35,19 77.52,17.17 OK1.8
N$60  (via drill 0.3)
  Top 0.203: v74.07,24.69 83.41,24.69 100.08,8.03 IO2.1
  Bottom 0.203: D7.2 64.52,24.69 67.87,24.69 OK1.4 67.97,24.69 v74.07,24.69
N$68
  Bottom 0.203: IC2.22 59.13,32 59.13,31.29 64.52,25.91 73.76,25.91 77.42,22.25 OK1.6
PRV_TALLY
  Top 0.203: R39.2 109.93,23.88 109.93,24.69 105.46,29.16 105.46,29.46 101.91,33.02 81.18,33.02 60.25,53.95 54.46,53.95 53.14,55.27 GND.D4
PWM_IRIS
  Top 0.203: R11.2 87.38,52.22 68.68,52.22 63.91,57 52.32,57 50.6,55.27 GND.D5
RES
  Bottom 0.203: RESETA.1 13.21,58.62 11.89,57.3 11.89,46.53 32.72,25.7 32.72,7.01 GND.RES
RESET
  Top 0.203: T6.3 110.03,16.97 116.74,16.97 X6.3
VIN  (via drill 0.3)
  Top 0.305: C15.1 91.14,61.98 91.14,60.05 C7.1 91.03,59.94 87.48,59.94 85.85,58.32 85.85,54.97 86.67,54.15 87.38,54.15 IC5.8 87.38,53.95 v88.09,53.24 | v92.56,46.02 92.35,46.02 v91.14,47.24 | v69.09,43.79 69.8,43.08 69.8,38.81 45.52,14.53 45.52,7.01 GND.VIN
  Bottom 0.305: C9.1 94.89,44.09 94.89,45.92 95,46.02 L1.2 94.79,46.02 v92.56,46.02 | v91.14,47.24 91.14,48.26 88.09,51.31 | v88.09,53.24 88.09,51.31 | v69.09,43.79 76.5,51.21 87.99,51.21 88.09,51.31

### Text on the board
_tsilk: SCL SDA
_bsilk: SKAARHOJ 2015 | GITHUB: SKAARHOJ-Open-Engineering | PCB-CCU-IRISCTRL-ETHERMEGA | v06-15 | OUTPUT | INPUT